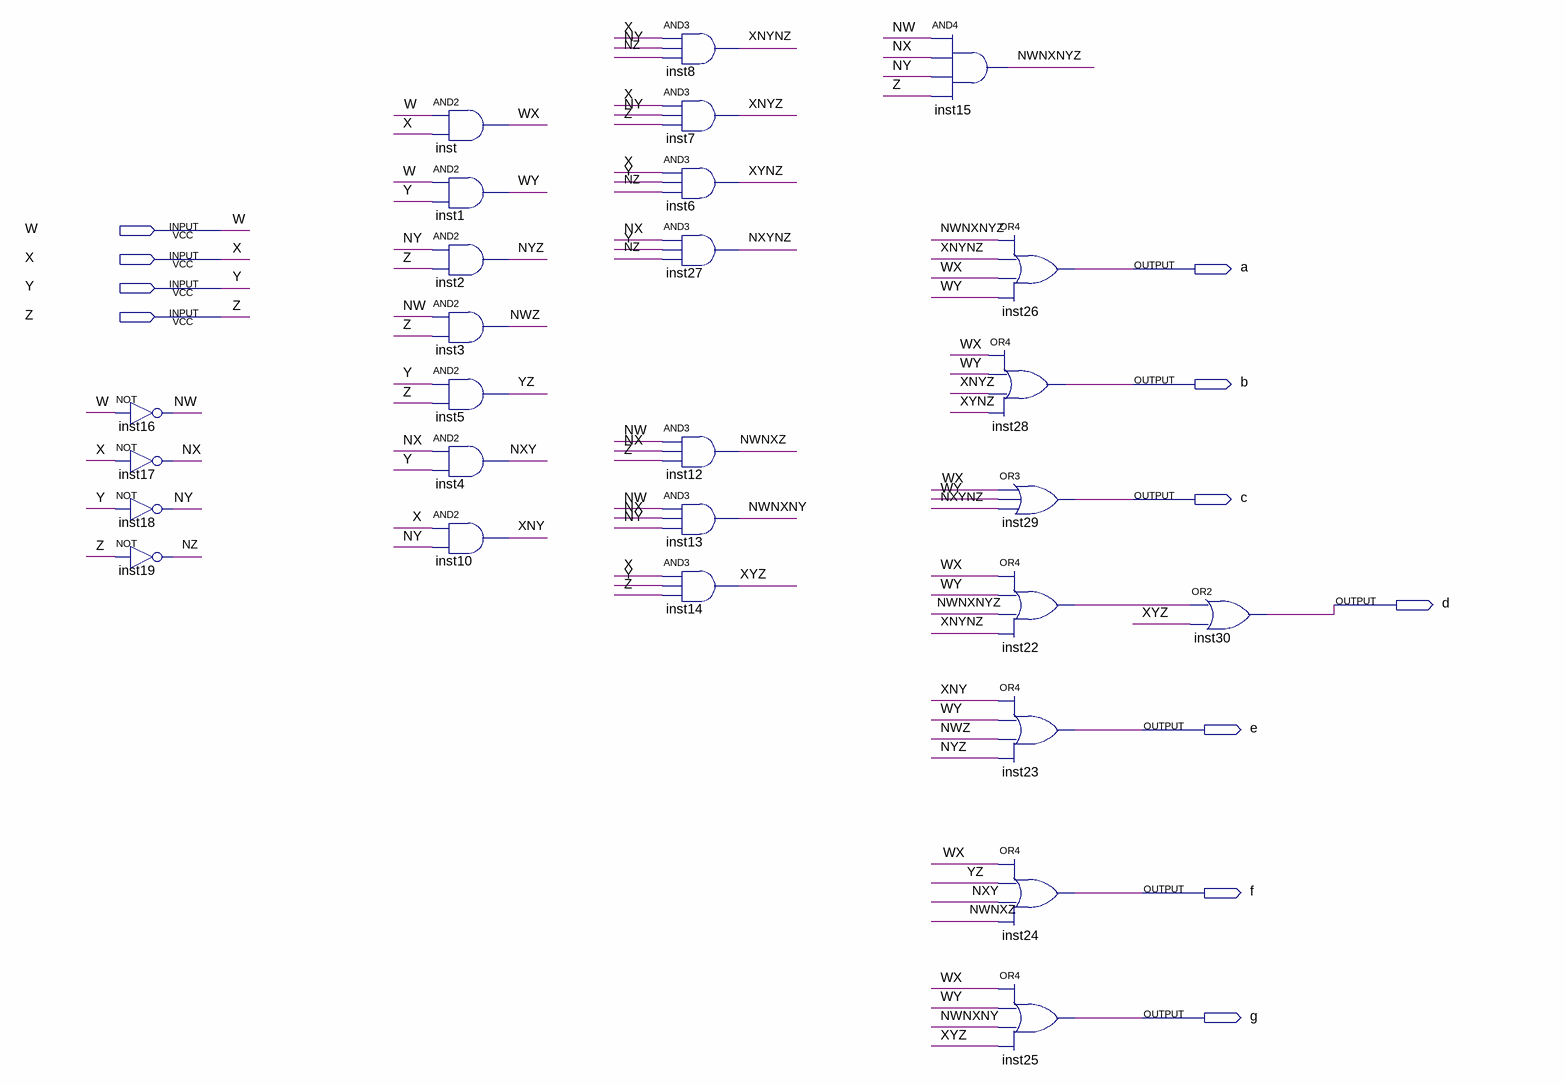
[diagram p0: schematic sheet]
// Quartus schematic Decodificador.bdf as structural Verilog: 27 symbols, 11 pins
module Decodificador (
  input  W,
  input  X,
  input  Y,
  input  Z,
  output a,
  output b,
  output c,
  output d,
  output e,
  output f,
  output g
);

  wire inst22_out, NW, NWNXNY, NWNXNYZ, NWNXZ, NWZ, NX, NXY, NXYNZ, NY, NYZ, NZ, WX, WY, XNY, XNYNZ, XNYZ,
       XYNZ, XYZ, YZ;

  not inst16 (NW, W);
  not inst17 (NX, X);
  not inst18 (NY, Y);
  not inst19 (NZ, Z);
  and inst (WX, W, X);
  and inst1 (WY, W, Y);
  and inst2 (NYZ, NY, Z);
  and inst3 (NWZ, NW, Z);
  and inst5 (YZ, Y, Z);
  and inst4 (NXY, NX, Y);
  and inst10 (XNY, X, NY);
  and inst8 (XNYNZ, X, NY, NZ);
  and inst7 (XNYZ, X, NY, Z);
  and inst6 (XYNZ, X, Y, NZ);
  and inst27 (NXYNZ, NX, Y, NZ);
  and inst12 (NWNXZ, NW, NX, Z);
  and inst13 (NWNXNY, NW, NX, NY);
  and inst14 (XYZ, X, Y, Z);
  and inst15 (NWNXNYZ, NW, NX, NY, Z);
  or inst26 (a, NWNXNYZ, XNYNZ, WX, WY);
  or inst28 (b, WX, WY, XNYZ, XYNZ);
  or inst29 (c, WX, WY, NXYNZ);
  or inst22 (inst22_out, WX, WY, NWNXNYZ, XNYNZ);
  or inst23 (e, XNY, WY, NWZ, NYZ);
  or inst24 (f, WX, YZ, NXY, NWNXZ);
  or inst25 (g, WX, WY, NWNXNY, XYZ);
  or inst30 (d, inst22_out, XYZ);
endmodule
